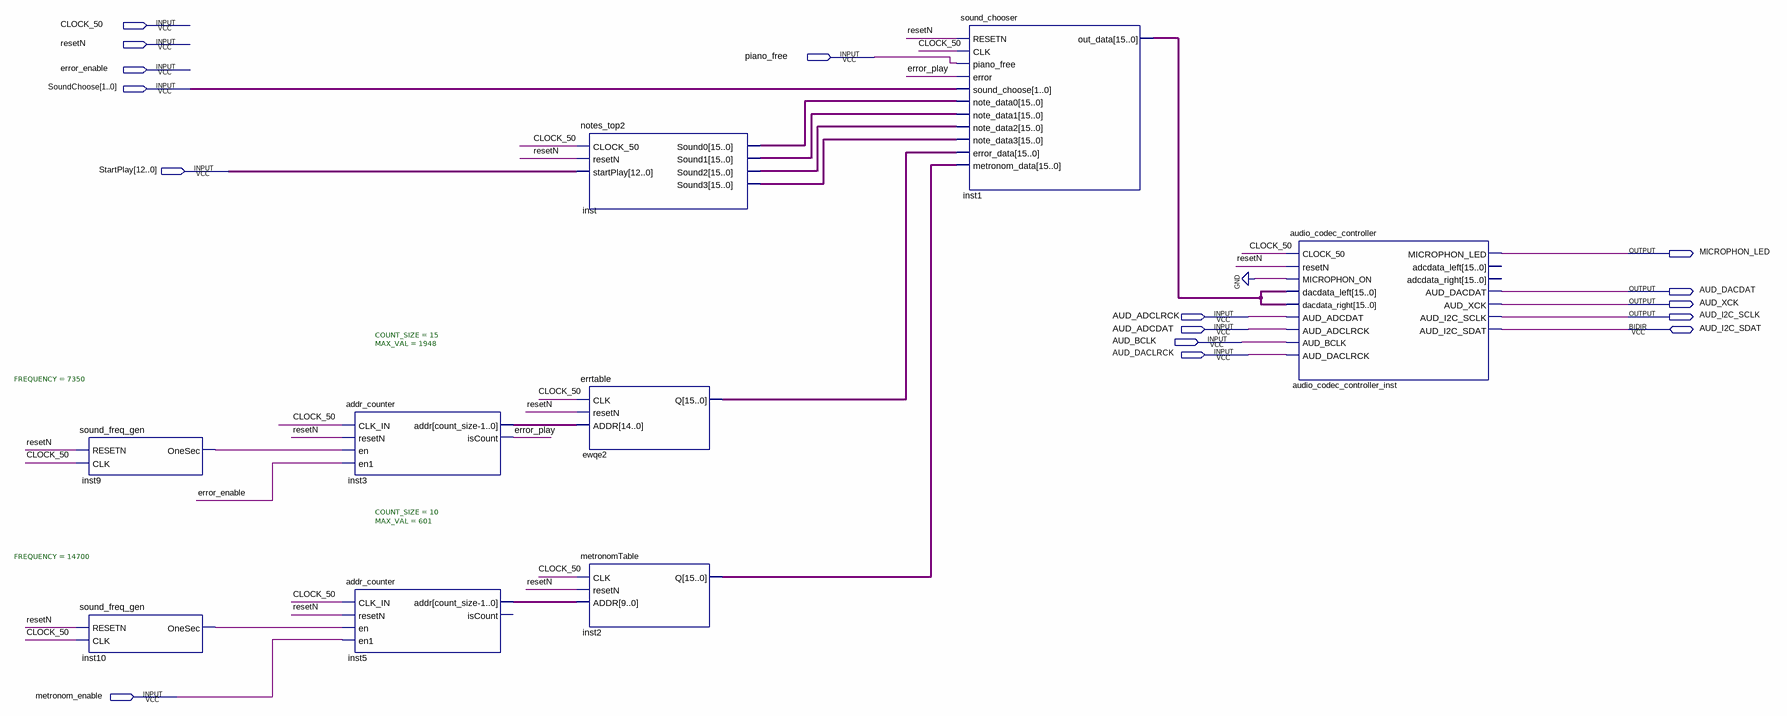
[diagram p0: schematic sheet]
// Quartus schematic audio_module_diag.bdf as structural Verilog: 9 symbols, 16 pins
module audio_module_diag (
  input  CLOCK_50,
  input  resetN,
  input  piano_free,
  input  error_enable,
  input  [1:0] SoundChoose,
  input  [12:0] StartPlay,
  input  AUD_ADCLRCK,
  input  AUD_ADCDAT,
  input  AUD_BCLK,
  input  AUD_DACLRCK,
  input  metronom_enable,
  inout  AUD_I2C_SDAT,
  output MICROPHON_LED,
  output AUD_DACDAT,
  output AUD_XCK,
  output AUD_I2C_SCLK
);

  wire error_play, inst9_onesec, inst10_onesec;
  wire [9:0] inst5_addr;
  wire [14:0] inst3_addr;
  wire [15:0] ewqe2_q, inst1_out_data, inst2_q, inst_sound0, inst_sound1, inst_sound2, inst_sound3;

  sound_freq_gen #(.FREQUENCY(7350)) inst9 (.RESETN(resetN), .CLK(CLOCK_50), .OneSec(inst9_onesec));
  sound_freq_gen #(.FREQUENCY(14700)) inst10 (.RESETN(resetN), .CLK(CLOCK_50), .OneSec(inst10_onesec));
  addr_counter #(.COUNT_SIZE(15), .MAX_VAL(1948)) inst3 (
    .CLK_IN(CLOCK_50), .resetN(resetN), .en(inst9_onesec), .en1(error_enable), .addr(inst3_addr),
    .isCount(error_play));
  addr_counter #(.COUNT_SIZE(10), .MAX_VAL(601)) inst5 (
    .CLK_IN(CLOCK_50), .resetN(resetN), .en(inst10_onesec), .en1(metronom_enable), .addr(inst5_addr));  // open: isCount
  notes_top2 inst (
    .CLOCK_50(CLOCK_50), .resetN(resetN), .startPlay(StartPlay), .Sound0(inst_sound0), .Sound1(inst_sound1),
    .Sound2(inst_sound2), .Sound3(inst_sound3));
  errtable ewqe2 (.CLK(CLOCK_50), .resetN(resetN), .ADDR(inst3_addr), .Q(ewqe2_q));
  metronomTable inst2 (.CLK(CLOCK_50), .resetN(resetN), .ADDR(inst5_addr), .Q(inst2_q));
  sound_chooser inst1 (
    .RESETN(resetN), .CLK(CLOCK_50), .piano_free(piano_free), .error(error_play), .sound_choose(SoundChoose),
    .note_data0(inst_sound0), .note_data1(inst_sound1), .note_data2(inst_sound2), .note_data3(inst_sound3),
    .error_data(ewqe2_q), .metronom_data(inst2_q), .out_data(inst1_out_data));
  audio_codec_controller audio_codec_controller_inst (
    .CLOCK_50(CLOCK_50), .resetN(resetN), .MICROPHON_ON(1'b0), .dacdata_left(inst1_out_data),
    .dacdata_right(inst1_out_data), .AUD_ADCDAT(AUD_ADCLRCK), .AUD_ADCLRCK(AUD_ADCDAT), .AUD_BCLK(AUD_BCLK),
    .AUD_DACLRCK(AUD_DACLRCK), .MICROPHON_LED(MICROPHON_LED), .AUD_DACDAT(AUD_DACDAT), .AUD_XCK(AUD_XCK),
    .AUD_I2C_SCLK(AUD_I2C_SCLK), .AUD_I2C_SDAT(AUD_I2C_SDAT));  // open: adcdata_left, adcdata_right
endmodule
